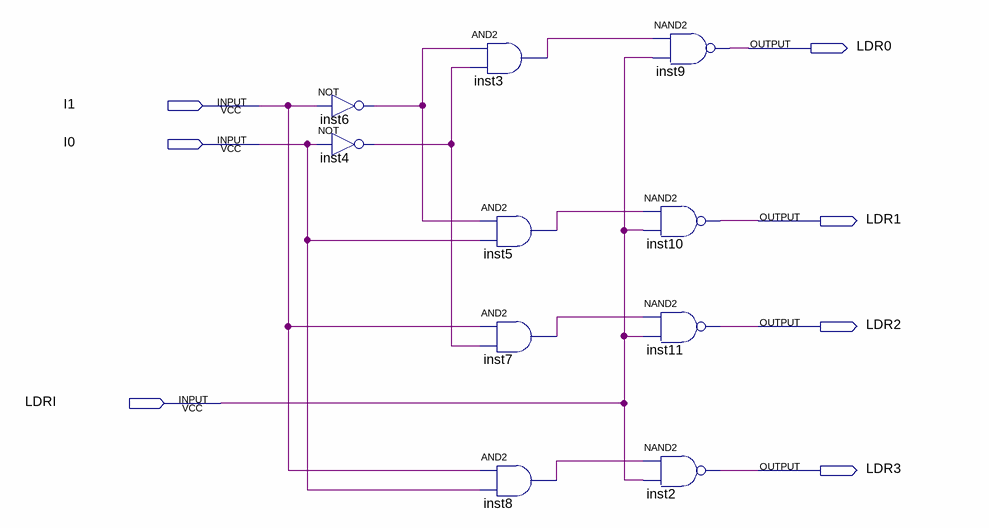
[diagram p0: schematic sheet]
// Quartus schematic RegControl.bdf as structural Verilog: 10 symbols, 7 pins
module RegControl (
  input  I1,
  input  I0,
  input  LDRI,
  output LDR0,
  output LDR1,
  output LDR2,
  output LDR3
);

  wire inst3_out, inst4_out, inst5_out, inst6_out, inst7_out, inst8_out;

  not inst6 (inst6_out, I1);
  not inst4 (inst4_out, I0);
  and inst3 (inst3_out, inst6_out, inst4_out);
  and inst5 (inst5_out, inst6_out, I0);
  and inst7 (inst7_out, I1, inst4_out);
  and inst8 (inst8_out, I1, I0);
  nand inst9 (LDR0, inst3_out, LDRI);
  nand inst10 (LDR1, inst5_out, LDRI);
  nand inst11 (LDR2, inst7_out, LDRI);
  nand inst2 (LDR3, inst8_out, LDRI);
endmodule
